# EAGLE schematic Tugas Day 0- William Chandra (EAGLE 7.6.0)
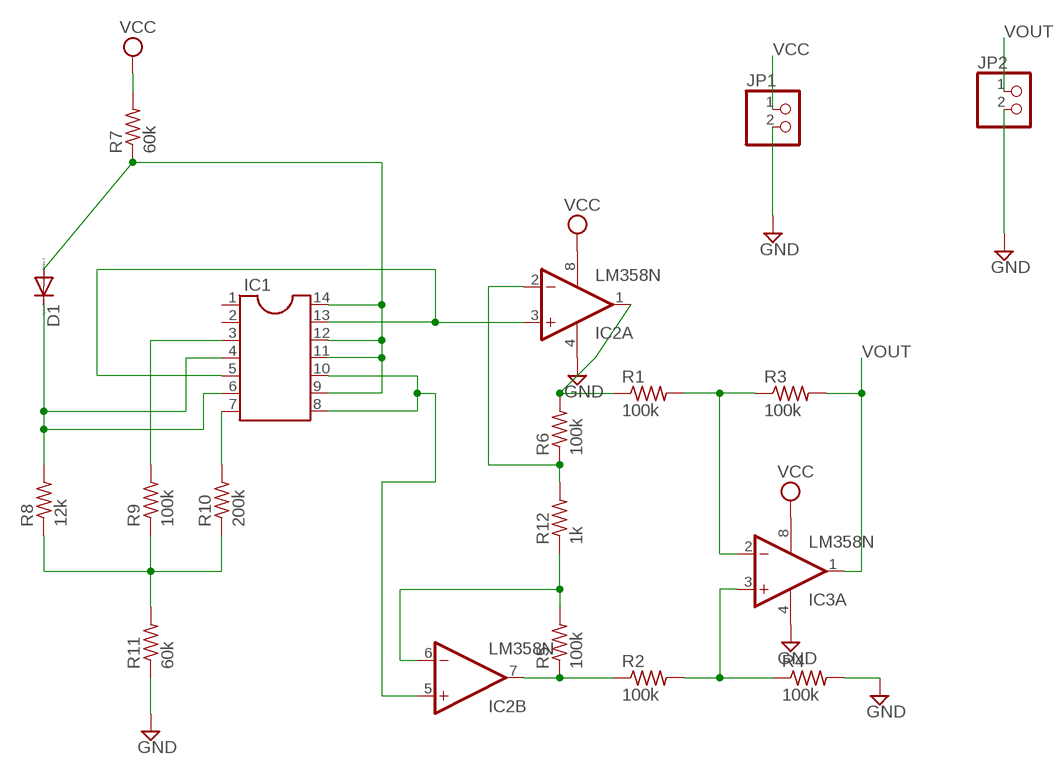
[diagram p0: schematic, sheet 1]

## Parts
D1  DIODE-D-7.5  [D-7.5]
IC1  DIL14  [DIL14]
IC2  LM358N  [DIL08]
IC3  LM358N  [DIL08]
JP1  PINHD-1X2  [1X02]
JP2  PINHD-1X2  [1X02]
R1  100k  R-US_0207/7  [0207/7]
R2  100k  R-US_0207/7  [0207/7]
R3  100k  R-US_0207/7  [0207/7]
R4  100k  R-US_0207/7  [0207/7]
R5  100k  R-US_0207/7  [0207/7]
R6  100k  R-US_0207/7  [0207/7]
R7  60k  R-US_0207/7  [0207/7]
R8  12k  R-US_0207/7  [0207/7]
R9  100k  R-US_0207/7  [0207/7]
R10  200k  R-US_0207/7  [0207/7]
R11  60k  R-US_0207/7  [0207/7]
R12  1k  R-US_0207/7  [0207/7]

## Nets
GND: IC2.4(P:V-) IC3.4(P:V-) JP1.2 JP2.2 R4.2 R11.1
N$1: IC3.3(A:+IN) R2.2 R4.1
N$2: IC3.2(A:-IN) R1.2 R3.1
N$3: IC2.1(A:OUT) R1.1 R6.2
N$4: IC2.2(A:-IN) R6.1 R12.2
N$5: IC2.6(B:-IN) R5.2 R12.1
N$6: IC2.7(B:OUT) R2.1 R5.1
N$7: R8.1 R9.1 R10.1 R11.2
N$8: D1.C IC1.4 IC1.6 R8.2
N$9: IC1.7 R10.2
N$10: IC1.3 R9.2
N$11: D1.A IC1.9 IC1.11 IC1.12 IC1.14 R7.1
N$12: IC1.5 IC1.13 IC2.3(A:+IN)
N$13: IC1.8 IC1.10 IC2.5(B:+IN)
VCC: IC2.8(P:V+) IC3.8(P:V+) JP1.1 R7.2
VOUT: IC3.1(A:OUT) JP2.1 R3.2
Unconnected: IC1.1 IC1.2 IC3.5(B:+IN) IC3.6(B:-IN) IC3.7(B:OUT)

## Library data of the parts
D1 = diode:DIODE-: DIODE
IC1 = ic-package:DIL14: Dual In Line / Socket
IC2 IC3 = linear:LM358: OP AMP also LM158; LM258; LM2904 Source: http://cache.national.com/ds/LM/LM158.pdf
JP1 JP2 = pinhead:PINHD-1X2: PIN HEADER
R1-R12 = resistor:R-US_: RESISTOR, American symbol